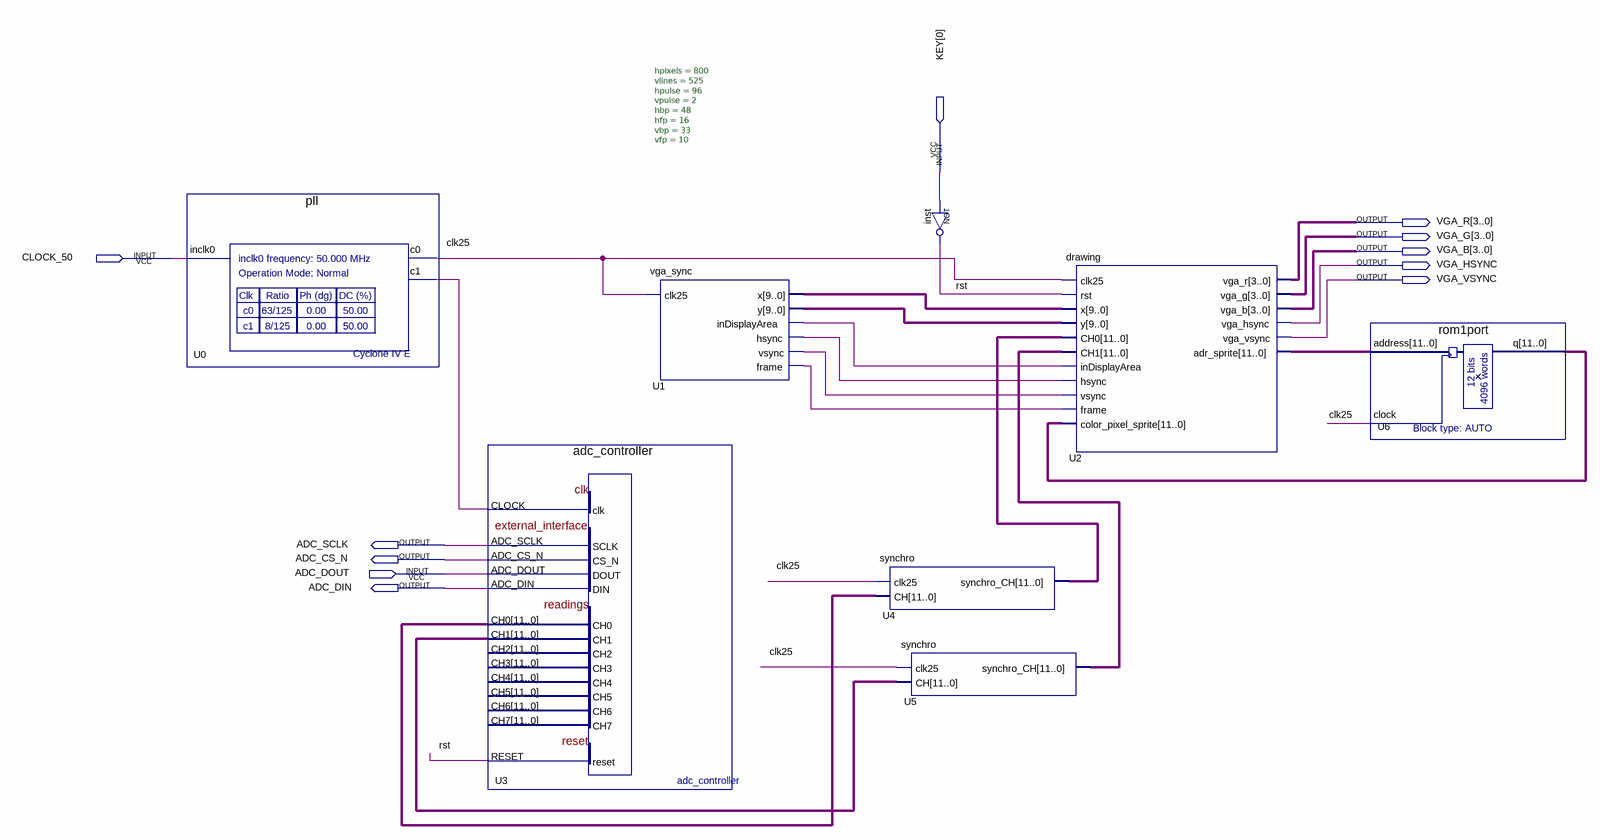
[diagram p0: schematic sheet]
// Quartus schematic Block_main.bdf as structural Verilog: 8 symbols, 11 pins
module Block_main (
  input  [0:0] KEY,
  input  CLOCK_50,
  input  ADC_DOUT,
  output [3:0] VGA_R,
  output [3:0] VGA_G,
  output [3:0] VGA_B,
  output VGA_HSYNC,
  output VGA_VSYNC,
  output ADC_SCLK,
  output ADC_CS_N,
  output ADC_DIN
);

  wire clk25, rst, U0_c1, U1_frame, U1_hsync, U1_indisplayarea, U1_vsync;
  wire [9:0] U1_x, U1_y;
  wire [11:0] U2_adr_sprite, U3_ch0, U3_ch1, U4_synchro_ch, U5_synchro_ch, U6_q;

  pll U0 (.inclk0(CLOCK_50), .c0(clk25), .c1(U0_c1));
  adc_controller U3 (
    .CLOCK(U0_c1), .ADC_DOUT(ADC_DOUT), .RESET(rst), .ADC_SCLK(ADC_SCLK), .ADC_CS_N(ADC_CS_N),
    .ADC_DIN(ADC_DIN), .CH0(U3_ch0), .CH1(U3_ch1));  // open: CH2, CH3, CH4, CH5, CH6, CH7
  vga_sync #(.hpixels(800), .vlines(525), .hpulse(96), .vpulse(2), .hbp(48), .hfp(16), .vbp(33), .vfp(10)) U1 (
    .clk25(clk25), .x(U1_x), .y(U1_y), .inDisplayArea(U1_indisplayarea), .hsync(U1_hsync), .vsync(U1_vsync),
    .frame(U1_frame));
  synchro U4 (.clk25(clk25), .CH(U3_ch0), .synchro_CH(U4_synchro_ch));
  synchro U5 (.clk25(clk25), .CH(U3_ch1), .synchro_CH(U5_synchro_ch));
  not inst (rst, KEY[0]);
  drawing U2 (
    .clk25(clk25), .rst(rst), .x(U1_x), .y(U1_y), .CH0(U4_synchro_ch), .CH1(U5_synchro_ch),
    .inDisplayArea(U1_indisplayarea), .hsync(U1_hsync), .vsync(U1_vsync), .frame(U1_frame),
    .color_pixel_sprite(U6_q), .vga_r(VGA_R), .vga_g(VGA_G), .vga_b(VGA_B), .vga_hsync(VGA_HSYNC),
    .vga_vsync(VGA_VSYNC), .adr_sprite(U2_adr_sprite));
  rom1port U6 (.address(U2_adr_sprite), .clock(clk25), .q(U6_q));
endmodule
